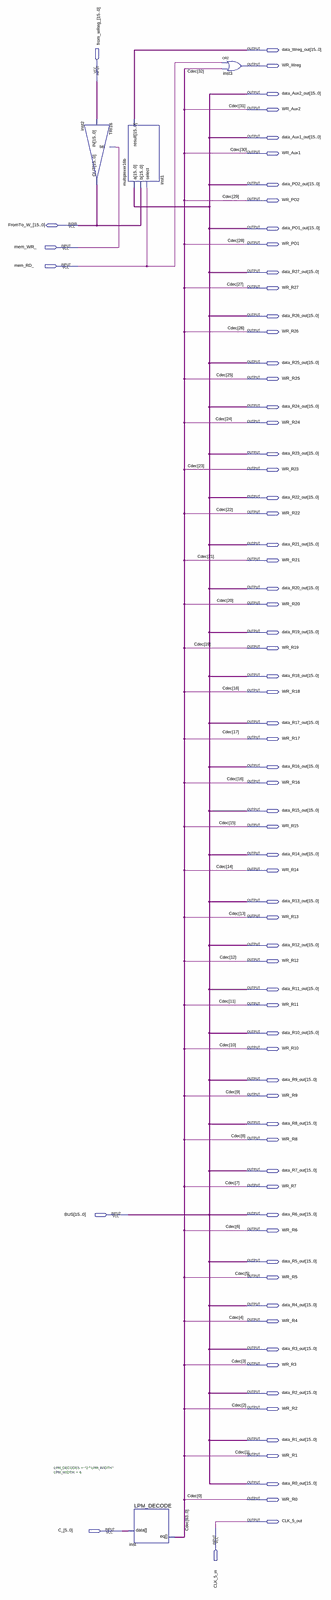
[diagram p0: schematic sheet, whole]
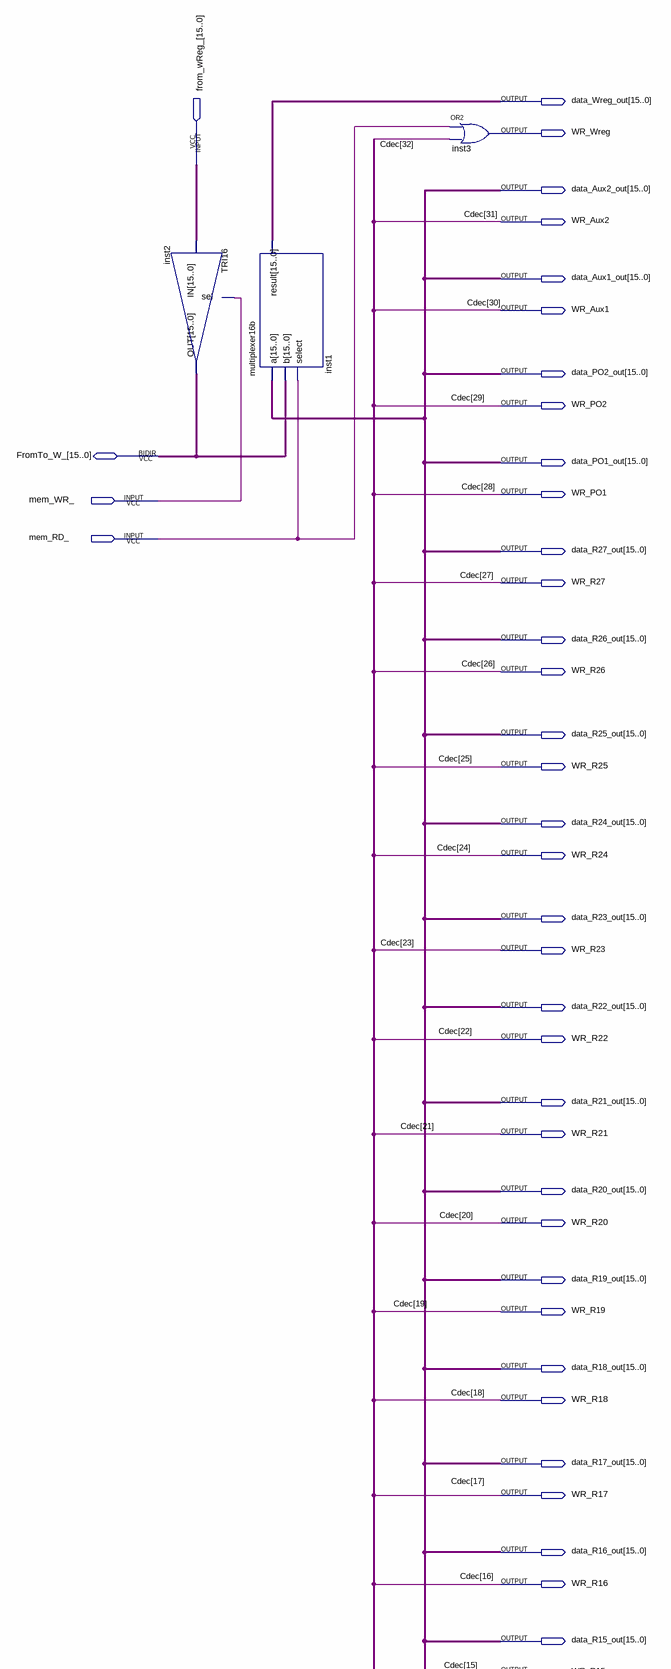
[diagram p1: schematic sheet, upper part]
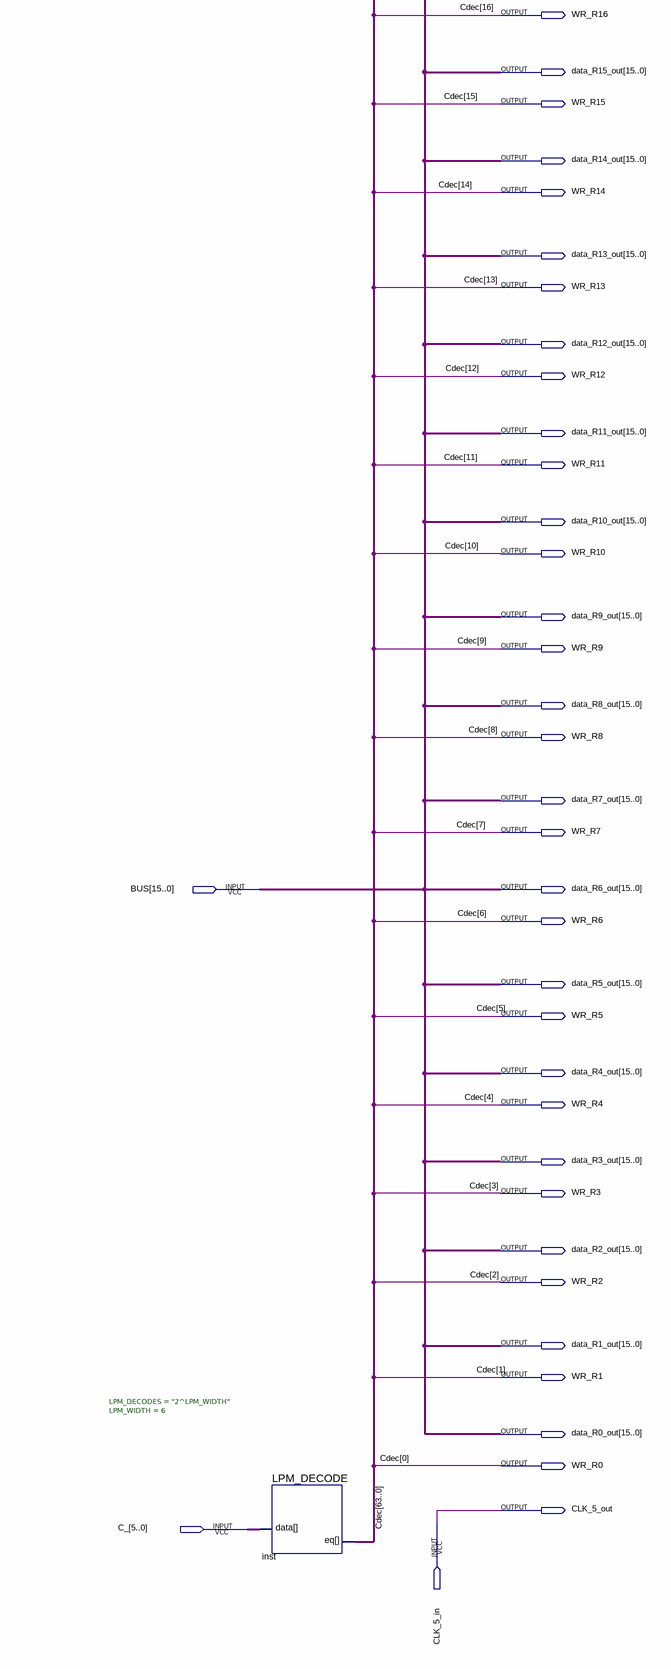
[diagram p2: schematic sheet, lower part]
// Quartus schematic block2.bdf as structural Verilog: 4 symbols, 74 pins
module block2 (
  input  [15:0] from_wReg_,
  input  mem_WR_,
  input  mem_RD_,
  input  [15:0] BUS,
  input  CLK_5_in,
  input  [5:0] C_,
  inout  [15:0] FromTo_W_,
  output [15:0] data_Wreg_out,
  output WR_Wreg,
  output [15:0] data_Aux2_out,
  output WR_Aux2,
  output [15:0] data_Aux1_out,
  output WR_Aux1,
  output [15:0] data_PO2_out,
  output WR_PO2,
  output [15:0] data_PO1_out,
  output WR_PO1,
  output [15:0] data_R27_out,
  output WR_R27,
  output [15:0] data_R26_out,
  output WR_R26,
  output [15:0] data_R25_out,
  output WR_R25,
  output [15:0] data_R24_out,
  output WR_R24,
  output [15:0] data_R23_out,
  output WR_R23,
  output [15:0] data_R22_out,
  output WR_R22,
  output [15:0] data_R21_out,
  output WR_R21,
  output [15:0] data_R20_out,
  output WR_R20,
  output [15:0] data_R19_out,
  output WR_R19,
  output [15:0] data_R18_out,
  output WR_R18,
  output [15:0] data_R17_out,
  output WR_R17,
  output [15:0] data_R16_out,
  output WR_R16,
  output [15:0] data_R15_out,
  output WR_R15,
  output [15:0] data_R14_out,
  output WR_R14,
  output [15:0] data_R13_out,
  output WR_R13,
  output [15:0] data_R12_out,
  output WR_R12,
  output [15:0] data_R11_out,
  output WR_R11,
  output [15:0] data_R10_out,
  output WR_R10,
  output [15:0] data_R9_out,
  output WR_R9,
  output [15:0] data_R8_out,
  output WR_R8,
  output [15:0] data_R7_out,
  output WR_R7,
  output [15:0] data_R6_out,
  output WR_R6,
  output [15:0] data_R5_out,
  output WR_R5,
  output [15:0] data_R4_out,
  output WR_R4,
  output [15:0] data_R3_out,
  output WR_R3,
  output [15:0] data_R2_out,
  output WR_R2,
  output [15:0] data_R1_out,
  output WR_R1,
  output [15:0] data_R0_out,
  output WR_R0,
  output CLK_5_out
);

  wire [63:32] Cdec;

  TRI16 inst2 (.sel(mem_WR_), .IN(from_wReg_), .OUT(FromTo_W_));
  multiplexer16b inst1 (.a(BUS), .b(FromTo_W_), .select(mem_RD_), .result(data_Wreg_out));
  LPM_DECODE #(.LPM_DECODES("2^LPM_WIDTH"), .LPM_WIDTH(6)) inst (
    .data(C_),
    .eq({Cdec, WR_Aux2, WR_Aux1, WR_PO2, WR_PO1, WR_R27, WR_R26, WR_R25, WR_R24, WR_R23, WR_R22, WR_R21, WR_R20, WR_R19, WR_R18, WR_R17, WR_R16, WR_R15, WR_R14, WR_R13, WR_R12, WR_R11, WR_R10, WR_R9, WR_R8, WR_R7, WR_R6, WR_R5, WR_R4, WR_R3, WR_R2, WR_R1, WR_R0}));
  or inst3 (WR_Wreg, mem_RD_, Cdec[32]);

  assign CLK_5_out = CLK_5_in;
  assign data_Aux1_out = BUS;
  assign data_Aux2_out = BUS;
  assign data_PO1_out = BUS;
  assign data_PO2_out = BUS;
  assign data_R0_out = BUS;
  assign data_R1_out = BUS;
  assign data_R2_out = BUS;
  assign data_R3_out = BUS;
  assign data_R4_out = BUS;
  assign data_R5_out = BUS;
  assign data_R6_out = BUS;
  assign data_R7_out = BUS;
  assign data_R8_out = BUS;
  assign data_R9_out = BUS;
  assign data_R10_out = BUS;
  assign data_R11_out = BUS;
  assign data_R12_out = BUS;
  assign data_R13_out = BUS;
  assign data_R14_out = BUS;
  assign data_R15_out = BUS;
  assign data_R16_out = BUS;
  assign data_R17_out = BUS;
  assign data_R18_out = BUS;
  assign data_R19_out = BUS;
  assign data_R20_out = BUS;
  assign data_R21_out = BUS;
  assign data_R22_out = BUS;
  assign data_R23_out = BUS;
  assign data_R24_out = BUS;
  assign data_R25_out = BUS;
  assign data_R26_out = BUS;
  assign data_R27_out = BUS;

  // Other names for the same wires on the sheet: Cdec[31:0] = {WR_Aux2, WR_Aux1, WR_PO2, WR_PO1, WR_R27, WR_R26, WR_R25, WR_R24, WR_R23, WR_R22, WR_R21, WR_R20, WR_R19, WR_R18, WR_R17, WR_R16, WR_R15, WR_R14, WR_R13, WR_R12, WR_R11, WR_R10, WR_R9, WR_R8, WR_R7, WR_R6, WR_R5, WR_R4, WR_R3, WR_R2, WR_R1, WR_R0}
endmodule
